# Altium schematic sheet PA_LNA.SchDoc
size A4
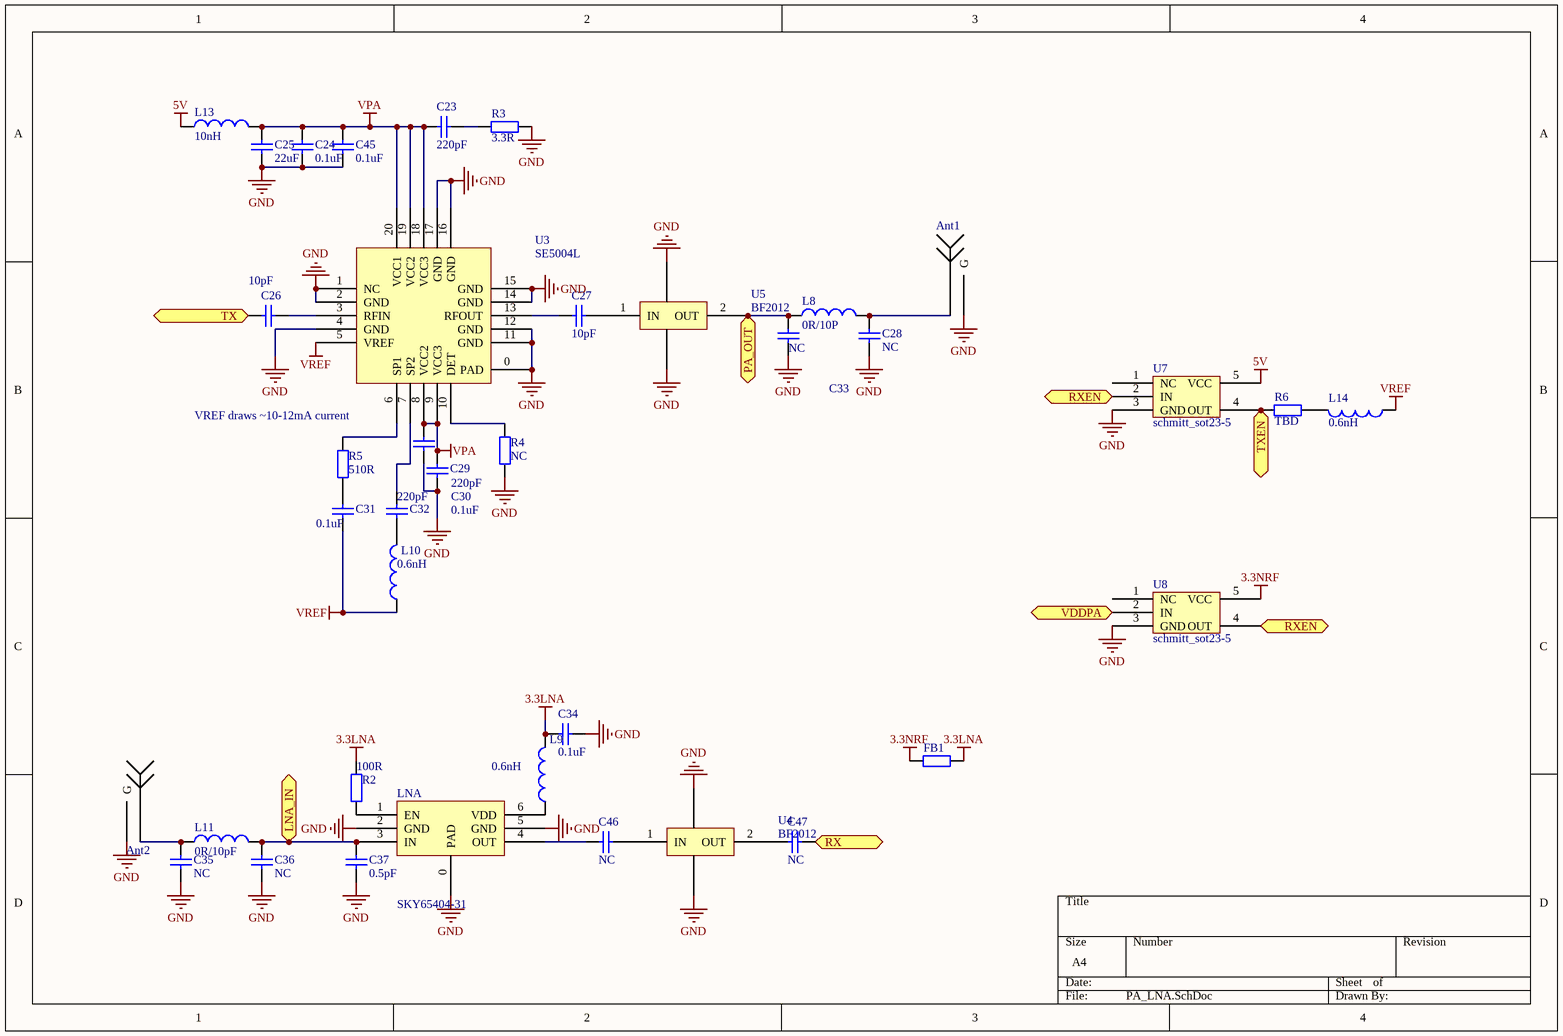
[diagram p0: PA_LNA.SchDoc]

## Parts
Ant1  Antenna  [SMA]  (value not drawn)
Ant2  Antenna  [SMA]  (value not drawn)
C23  value 220pF  [0402]  (hidden comment: Cap)
C24  value 0.1uF  [0402]  (hidden comment: Cap)
C25  value 22uF  [0805]  (hidden comment: Cap)
C26  value 10pF  [0402]  (hidden comment: Cap)
C27  value 10pF  [0402]  (hidden comment: Cap)
C28  value NC  [0402]  (hidden comment: Cap)
C29  value 0.1uF  [0402]  (hidden comment: Cap)
C30  value 220pF  [0402]  (hidden comment: Cap)
C31  value 0.1uF  [0402]  (hidden comment: Cap)
C32  value 220pF  [0402]  (hidden comment: Cap)
C33  value NC  [0402]  (hidden comment: Cap)
C34  value 0.1uF  [0402]  (hidden comment: Cap)
C35  value NC  [0402]  (hidden comment: Cap)
C36  value NC  [0402]  (hidden comment: Cap)
C37  value 0.5pF  [0402]  (hidden comment: Cap)
C45  value 0.1uF  [0402]  (hidden comment: Cap)
C46  value NC  [0402]  (hidden comment: Cap)
C47  value NC  [0402]  (hidden comment: Cap)
FB1  Res2  [0402]  (value not drawn)
L8  value 0R/10P  [0402]  (hidden comment: Inductor)
L9  value 0.6nH  [0402]  (hidden comment: Inductor)
L10  value 0.6nH  [0402]  (hidden comment: Inductor)
L11  value 0R/10pF  [0402]  (hidden comment: Inductor)
L13  value 10nH  [0402]  (hidden comment: Inductor)
L14  value 0.6nH  [0402]  (hidden comment: Inductor)
LNA  SKY65404-31  [SKY65404-31]
R2  value 100R  [0402]  (hidden comment: Res2)
R3  value 3.3R  [0402]  (hidden comment: Res2)
R4  value NC  [0402]  (hidden comment: Res2)
R5  value 510R  [0402]  (hidden comment: Res2)
R6  value TBD  [0402]  (hidden comment: Res2)
U3  SE5004L  [SE5004L]
U4  BF2012  [LFB2H5]
U5  BF2012  [LFB2H5]
U7  schmitt_sot23-5  [SOT23-5]
U8  schmitt_sot23-5  [SOT23-5]

## Ports
LNA_IN, PA_OUT, RX, RXEN, TX, TXEN, VDDPA

## Nets
3.3LNA: C34.2 FB1.2 L9.2 R2.2
3.3NRF: FB1.1 U8.5(VCC)
5V: L13.1 U7.5(VCC)
GND: Ant1.GND(G) Ant2.GND(G) C24.2 C25.1 C28.2 C29.1 C30.1 C33.2 C34.1 C35.1 C36.1 C37.1 C45.2 LNA.0(PAD) LNA.2(GND) LNA.5(GND) R3.1 R4.1 U3.0(PAD) U3.1(NC) U3.2(GND) U3.4(GND) U3.11(GND) U3.12(GND) U3.14(GND) U3.15(GND) U3.16(GND) U3.17(GND) U4.0(GND) U5.0(GND) U7.3(GND) U8.3(GND)
VPA: C23.2 C24.1 C25.2 C29.2 C30.2 C45.1 L13.2 U3.8(VCC2) U3.9(VCC3) U3.18(VCC3) U3.19(VCC2) U3.20(VCC1)
VREF: C31.1 L10.1 L14.1 U3.5(VREF)
LNA_IN: C36.2 C37.2 L11.2 LNA.3(IN) ; port LNA_IN
PA_OUT: C33.1 L8.1 U5.2(OUT) ; port PA_OUT
RX: C47.2 ; port RX
RXEN: U7.2(IN) U8.4(OUT) ; port RXEN
TX: C26.1 ; port TX
TXEN: R6.2 U7.4(OUT) ; port TXEN
VDDPA: U8.2(IN) ; port VDDPA
NetAnt1_1: Ant1.1 C28.1 L8.2
NetAnt2_1: Ant2.1 C35.2 L11.1
NetC23_1: C23.1 R3.2
NetC26_2: C26.2 U3.3(RFIN)
NetC27_1: C27.1 U3.13(RFOUT)
NetC27_2: C27.2 U5.1(IN)
NetC31_2: C31.2 R5.1
NetC32_1: C32.1 L10.2
NetC32_2: C32.2 U3.7(SP2)
NetC46_1: C46.1 LNA.4(OUT)
NetC46_2: C46.2 U4.1(IN)
NetC47_1: C47.1 U4.2(OUT)
NetL9_1: L9.1 LNA.6(VDD)
NetL14_2: L14.2 R6.1
NetLNA_1: LNA.1(EN) R2.1
NetR4_2: R4.2 U3.10(DET)
NetR5_2: R5.2 U3.6(SP1)

Not connected (* = marked no-connect by the designer): U7 1(NC); U8 1(NC)

## Notes on the sheet
- VREF draws ~10-12mA current

## Library data of the parts
C23-C37 C45-C47 = Cap: Capacitor; Published: 8-Jun-2000; LatestRevisionDate: 17-Jul-2002; LatestRevisionNote: Re-released for DXP Platform.; PackageReference: RAD-0.3; Publisher: Altium Limited; PackageDescription: Radial Cap, Thru-Hole; 2 Leads; 0.3 in Pin Spacing
FB1 = Res2: Resistor; Value: FB; Published: 8-Jun-2000; LatestRevisionDate: 17-Jul-2002; LatestRevisionNote: Re-released for DXP Platform.; PackageReference: AXIAL-0.4; Publisher: Altium Limited; PackageDescription: Axial Device, Thru-Hole; 2 Leads; 0.4 in Pin Spacing
L8-L11 L13 L14 = Inductor: Code_IEC: 1005; Published: 8-Jun-2000; LatestRevisionDate: 29-May-2009; LatestRevisionNote: IPC-7351 Footprint Added.; PackageReference: 0402-A; Publisher: Altium Limited; PackageDescription: Chip Inductor; Code_JEITA: 0402
R2-R6 = Res2: Resistor; Published: 8-Jun-2000; LatestRevisionDate: 17-Jul-2002; LatestRevisionNote: Re-released for DXP Platform.; PackageReference: AXIAL-0.4; Publisher: Altium Limited; PackageDescription: Axial Device, Thru-Hole; 2 Leads; 0.4 in Pin Spacing